# Altium schematic sheet MCU.SchDoc: MCU
size A4; DocumentNumber: 1; Revision: 1; SheetNumber: 2; SheetTotal: 5; SPICEModelCacheJNIDMDJG: <root> / <DocumentId>JNIDMDJG</DocumentId> / <CacheFrame Number="0"> / <Model Name="xtal" Kind="CKT"> / <Text>*Generic type:crystal pkg:HC33/51 / .SUBCKT XTAL 1 2 PARAMS: FREQ=1Meg RS=750 C=13pf Q=1000 / LX 1 3 {((Q*RS)/(6.2831852*FREQ))} IC=0.5M / CX 3 4 {(1/(Q*6.2831852*FREQ*RS))} / C0 1 2 {C} / RS 4 2 {RS} / .ENDS XTAL</Text> / </Model> / <Model Name="cap" Kind="MDL"> / <Text>*Default semiconductor capacitor / .MODEL CAP C()</Text> / </Model> / </CacheFrame> / </root>
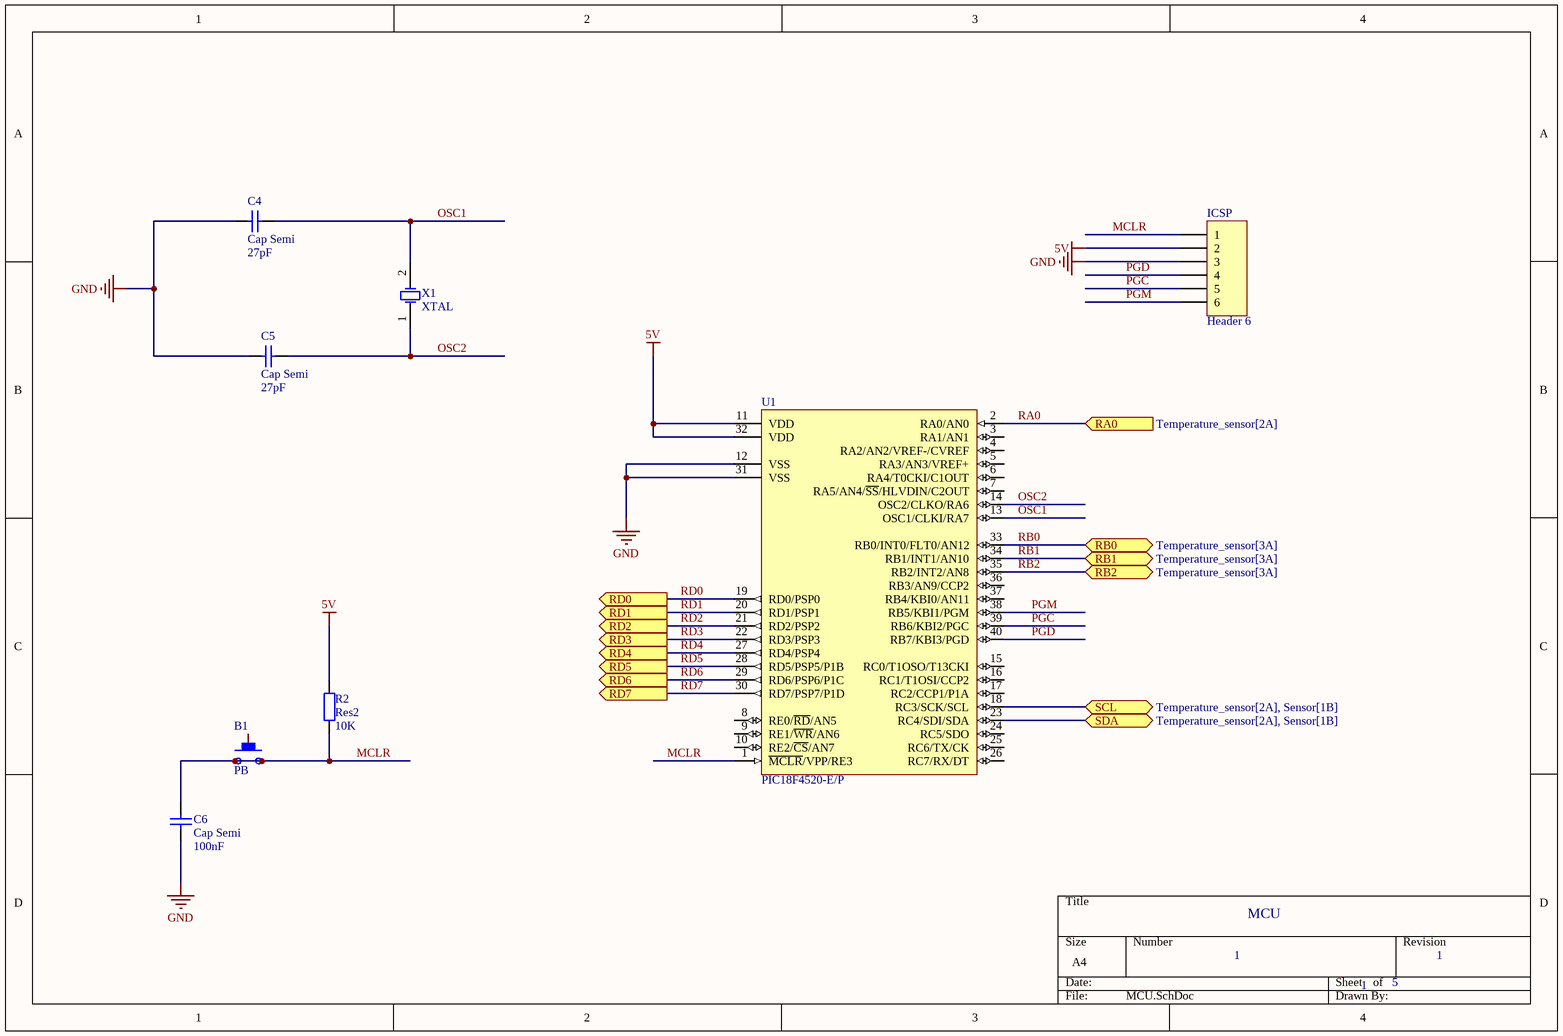
[diagram p0: MCU.SchDoc]

## Parts
B1  PB  [Push button]
C4  Cap Semi  value 27pF  [C1206]
C5  Cap Semi  value 27pF  [C1206]
C6  Cap Semi  value 100nF  [C1206]
ICSP  Header 6  [HDR1X6]
R2  Res2  value 10K  [0805]
U1  PIC18F4520-E/P  [PDIP600-P40]
X1  XTAL  [R38]

## Ports
RA0 (in, see Temperature_sensor[2A]), RB0 (bidir, see Temperature_sensor[3A]), RB1 (bidir, see Temperature_sensor[3A]), RB2 (bidir, see Temperature_sensor[3A]), RD0 (out), RD1 (out), RD2 (out), RD3 (out), RD4 (out), RD5 (out), RD6 (out), RD7 (out), SCL (bidir, see Temperature_sensor[2A], Sensor[1B]), SDA (bidir, see Temperature_sensor[2A], Sensor[1B])

## Nets
5V: ICSP.2 R2.2 U1.11(VDD) U1.32(VDD)
GND: C4.1 C5.1 C6.2 ICSP.3 U1.12(VSS) U1.31(VSS)
MCLR: B1.0 B1.1 C6.1 ICSP.1 R2.1 U1.1(~{MCLR}/VPP/RE3)
OSC1: C4.2 U1.13(OSC1/CLKI/RA7) X1.2(OSC2)
OSC2: C5.2 U1.14(OSC2/CLKO/RA6) X1.1(OSC1)
PGC: ICSP.5 U1.39(RB6/KBI2/PGC)
PGD: ICSP.4 U1.40(RB7/KBI3/PGD)
PGM: ICSP.6 U1.38(RB5/KBI1/PGM)
RA0: U1.2(RA0/AN0) ; port RA0
RB0: U1.33(RB0/INT0/FLT0/AN12) ; port RB0
RB1: U1.34(RB1/INT1/AN10) ; port RB1
RB2: U1.35(RB2/INT2/AN8) ; port RB2
RD0: U1.19(RD0/PSP0) ; port RD0
RD1: U1.20(RD1/PSP1) ; port RD1
RD2: U1.21(RD2/PSP2) ; port RD2
RD3: U1.22(RD3/PSP3) ; port RD3
RD4: U1.27(RD4/PSP4) ; port RD4
RD5: U1.28(RD5/PSP5/P1B) ; port RD5
RD6: U1.29(RD6/PSP6/P1C) ; port RD6
RD7: U1.30(RD7/PSP7/P1D) ; port RD7
SCL: U1.18(RC3/SCK/SCL) ; port SCL
SDA: U1.23(RC4/SDI/SDA) ; port SDA

Not connected (* = marked no-connect by the designer): U1 3(RA1/AN1) 4(RA2/AN2/VREF-/CVREF) 5(RA3/AN3/VREF+) 6(RA4/T0CKI/C1OUT) 7(RA5/AN4/~{SS}/HLVDIN/C2OUT) 8(RE0/~{RD}/AN5) 9(RE1/~{WR}/AN6) 10(RE2/~{CS}/AN7) 15(RC0/T1OSO/T13CKI) 16(RC1/T1OSI/CCP2) 17(RC2/CCP1/P1A) 24(RC5/SDO) 25(RC6/TX/CK) 26(RC7/RX/DT) 36(RB3/AN9/CCP2) 37(RB4/KBI0/AN11)

## Notes on the sheet
- MCU
- 1
- 5

## Library data of the parts
C4-C6 = Cap Semi: Capacitor (Semiconductor SIM Model); Published: 8-Jun-2000; LatestRevisionDate: 29-May-2009; LatestRevisionNote: IPC-7351 Footprint Added.; PackageReference: C1206; Publisher: Altium Limited; PackageDescription: Chip Capacitor
ICSP = Header 6: Header, 6-Pin; LatestRevisionDate: 17-Jul-2002; LatestRevisionNote: Re-released for DXP Platform.; Publisher: Altium Limited
R2 = Res2: Resistor; Published: 8-Jun-2000; LatestRevisionDate: 17-Jul-2002; LatestRevisionNote: Re-released for DXP Platform.; PackageReference: AXIAL-0.4; Publisher: Altium Limited; PackageDescription: Axial Device, Thru-Hole; 2 Leads; 0.4 in Pin Spacing
U1 = PIC18F4520-E/P: Enhanced Flash Microcontroller with 10-Bit A/D and nanoWatt Technology, 32K Flash, 40-Pin PDIP, Extended Temperature Range; Published: 29-Jan-2009; LatestRevisionDate: 02-Dec-2009; LatestRevisionNote: Updated to datasheet revision E, Oct-2008; DatasheetVersion: revE, Oct-2008; PackageVersion: revBB, Aug-2009; PackageReference: PDIP600-P40; Publisher: Altium Limited; PackageDescription: 40-Lead Plastic Dual In-Line (P) - 600 mil Body [PDIP]; Supplier 1: Digi-Key; Supplier Part Number 1: PIC18F4520-E/P-ND; ComponentLink1Description: Datasheet; ComponentLink1URL: http://ww1.microchip.com/downloads/en/DeviceDoc/39631E.pdf; ComponentLink2Description: Packaging Specification; ComponentLink2URL: http://www.microchip.com/stellent/groups/techpub_sg/documents/packagingspec/en012702.pdf; ComponentLink3Description: Microchip.com Home; ComponentLink3URL: http://www.microchip.com/
X1 = XTAL: Crystal Oscillator; Published: 8-Jun-2000; LatestRevisionDate: 17-Jul-2002; LatestRevisionNote: Re-released for DXP Platform.; PackageReference: R38; Publisher: Altium Limited; PackageDescription: Crystal, Thru-Hole; 2 Leads; Body 3.1 x 8.2 mm (Dia.xH)